# Altium schematic sheet Power supply.SchDoc
size 420 x 297 mm; SheetNumber: 1; SheetTotal: 1
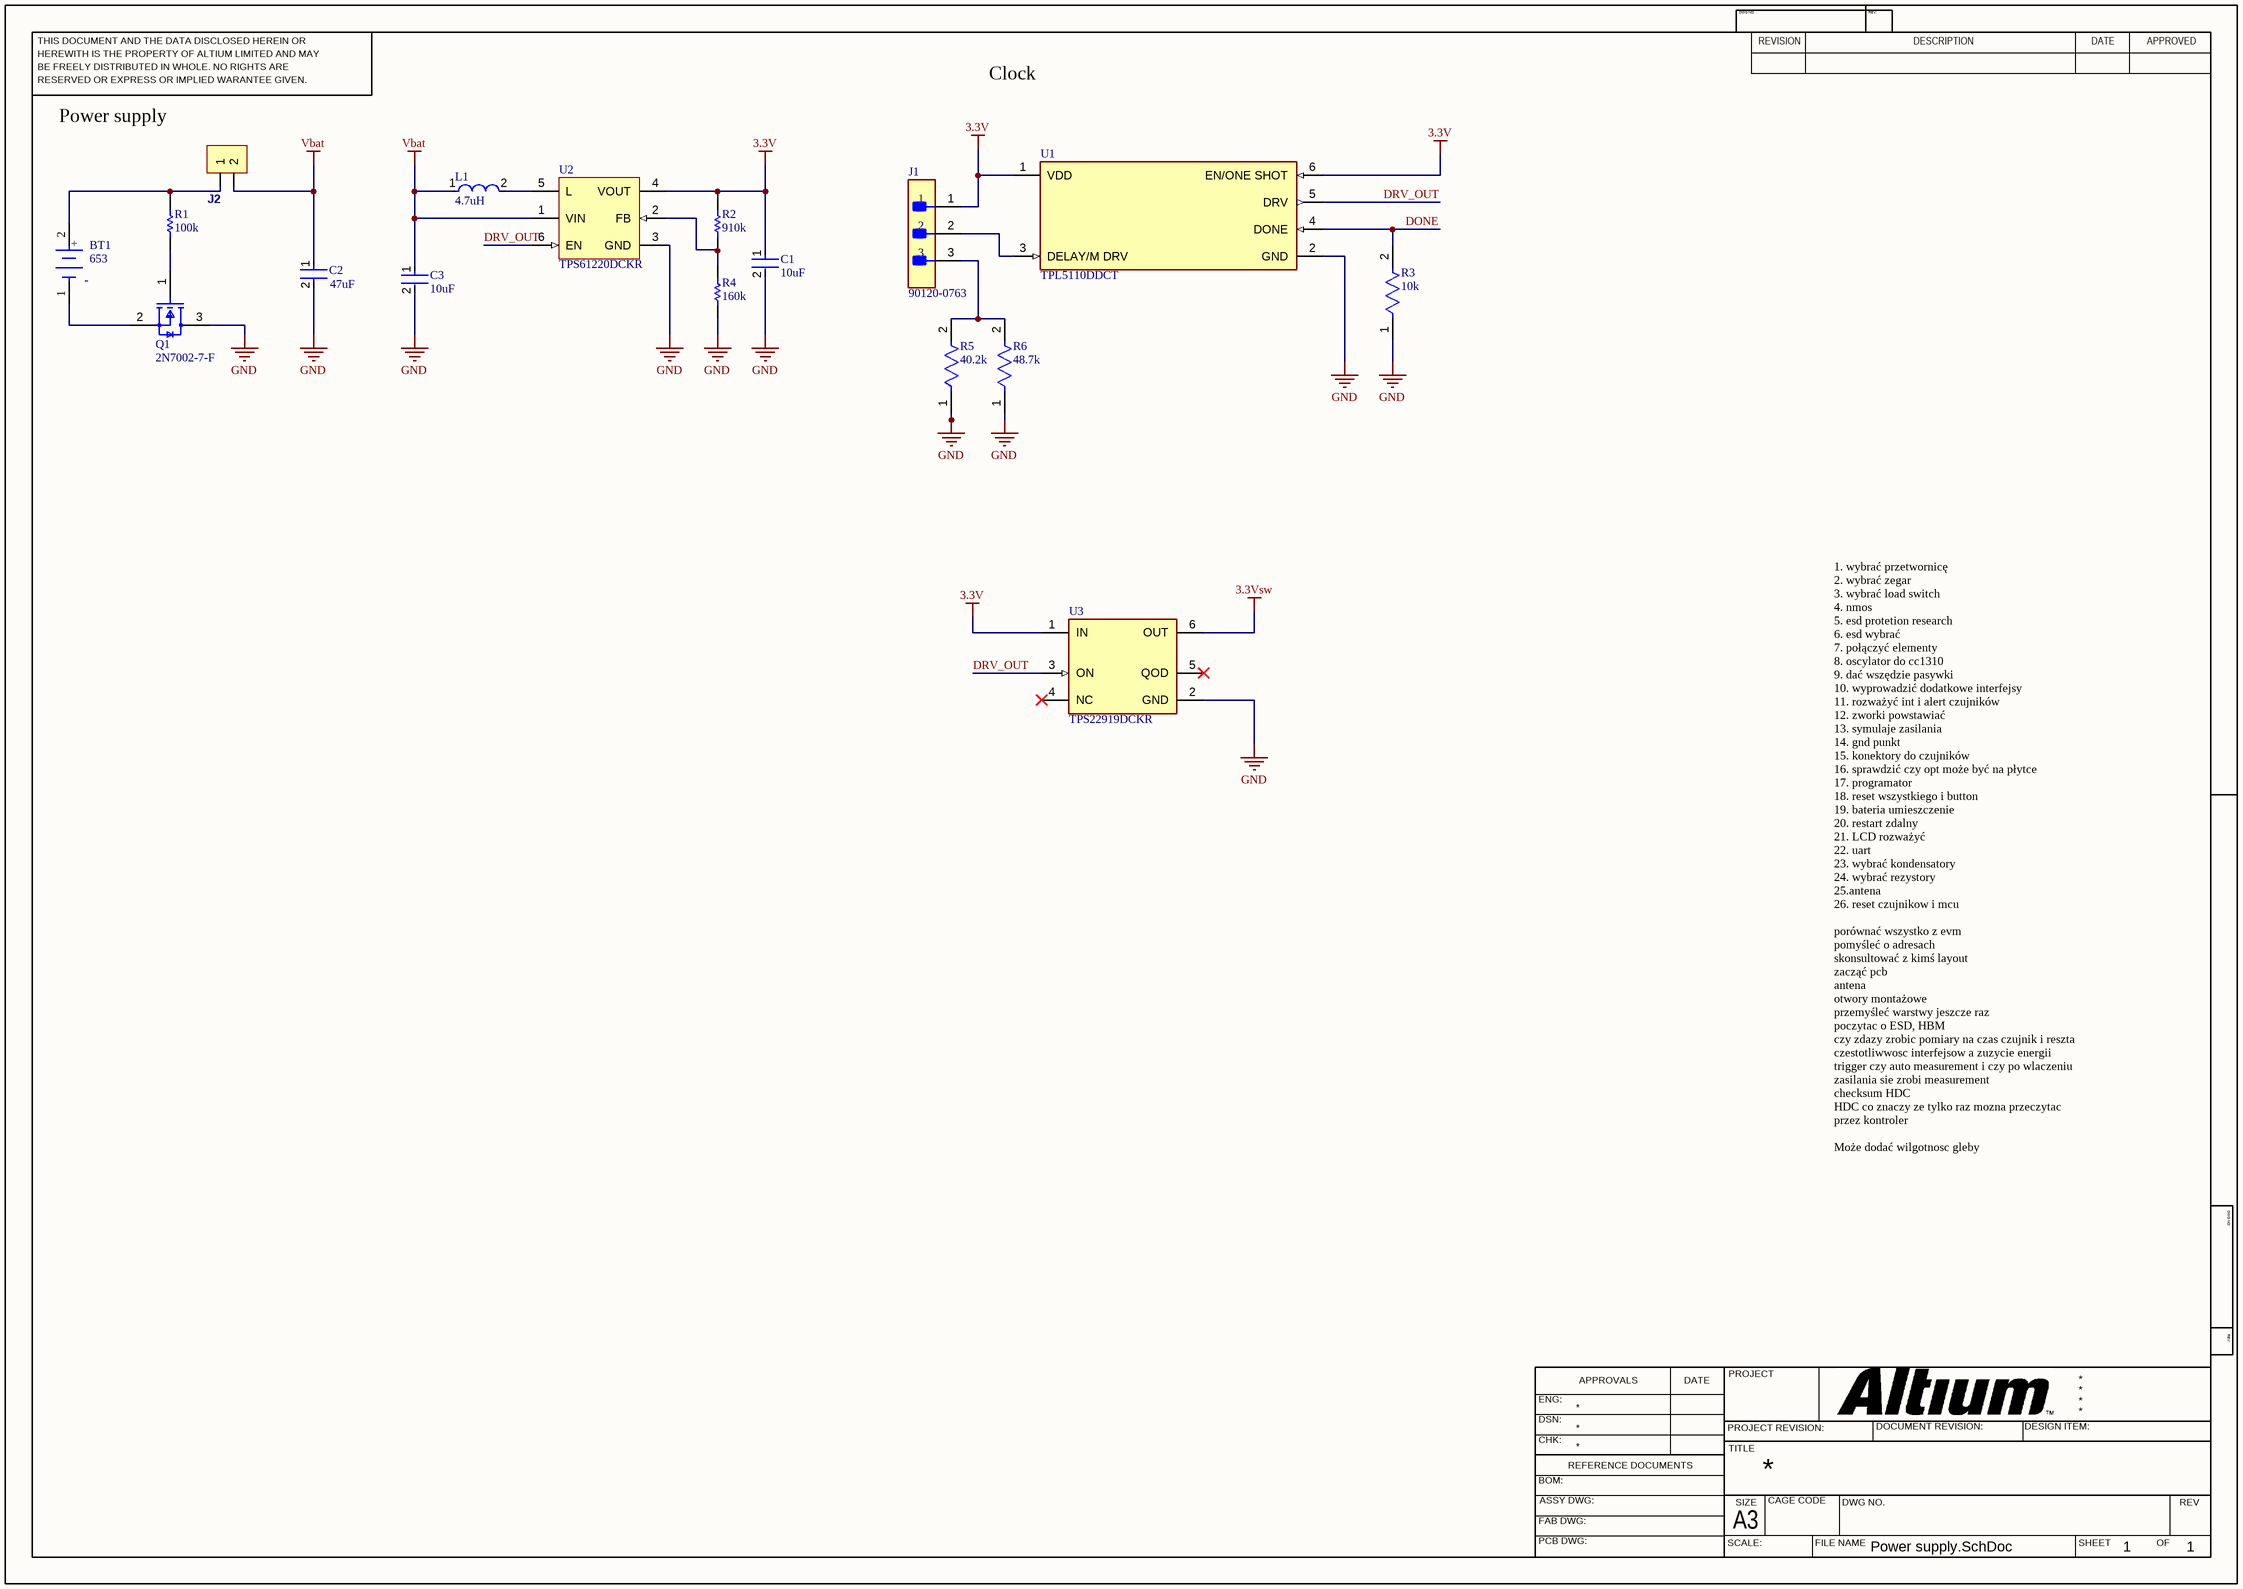
[diagram p0: Power supply.SchDoc]

## Parts
BT1  653  [FP-653-MFG]
C1  10uF  [FP-GRM188-0_2-MFG]
C2  47uF  [FP-GRM31C-0_2-e0_3_0_8-IPC_C]
C3  10uF  [FP-1210-L_3_3_0_4-W_2_5_0-IPC_A]
J1  90120-0763  [FP-90120-0763-MFG]
J2  CN_2x1  [GP_2x1]  (value not drawn)
L1  4.7uH  [FP-LQH3NPH_ME-MFG]
Q1  2N7002-7-F  [FP-SOT23-MFG]
R1  100k  [RESC0603(1608)_N]
R2  910k  [RESC3226X70X40NL20T20]
R3  10k  [FP-RK73HW3A-IPC_A]
R4  160k  [RESC3225X60X45LL20T20]
R5  40.2k  [FP-MCT0603-IPC_A]
R6  48.7k  [FP-MCT0603-IPC_A]
U1  TPL5110DDCT  [FP-DDC0006A-MFG]
U2  TPS61220DCKR  [DCK0006A_L]
U3  TPS22919DCKR  [FP-DCK0006A-MFG]

## Nets
3.3V: C1.1 J1.1 R2.2 U1.1(VDD) U1.6(EN/ONE_SHOT) U2.4(VOUT) U3.1(IN)
3.3Vsw: U3.6(OUT)
GND: C1.2 C2.2 C3.2 Q1.3(D) R3.1 R4.1 R5.1 R6.1 U1.2(GND) U2.3(GND) U3.2(GND)
Vbat: C2.1 C3.1 J2.2 L1.1 U2.1(VIN)
DONE: R3.2 U1.4(DONE)
DRV_OUT: U1.5(DRV) U2.6(EN) U3.3(ON)
NetBT1_1: BT1.1(C) Q1.2(S)
NetBT1_2: BT1.2(A) J2.1 R1.2
NetJ1_2: J1.2 U1.3(DELAY/M_DRV)
NetJ1_3: J1.3 R5.2 R6.2
NetL1_2: L1.2 U2.5(L)
NetQ1_1: Q1.1(G) R1.1
NetR2_1: R2.1 R4.2 U2.2(FB)

Not connected (* = marked no-connect by the designer): U3 4(NC)* 5(QOD)*

## Notes on the sheet
- Power supply
- Clock
- 1. wybrać przetwornicę
  2. wybrać zegar
  3. wybrać load switch
  4. nmos
  5. esd protetion research
  6. esd wybrać
  7. połączyć elementy
  8. oscylator do cc1310
  9. dać wszędzie pasywki
  10. wyprowadzić dodatkowe interfejsy
  11. rozważyć int i alert czujników
  12. zworki powstawiać
  13. symulaje zasilania
  14. gnd punkt
  15. konektory do czujników
  16. sprawdzić czy opt może być na płytce
  17. programator
  18. reset wszystkiego i button
  19. bateria umieszczenie
  20. restart zdalny
  21. LCD rozważyć
  22. uart
  23. wybrać kondensatory
  24. wybrać rezystory
  25.antena
  26. reset czujnikow i mcu
  porównać wszystko z evm
  pomyśleć o adresach
  skonsultować z kimś layout
  zacząć pcb
  antena
  otwory montażowe
  przemyśleć warstwy jeszcze raz
  poczytac o ESD, HBM
  czy zdazy zrobic pomiary na czas czujnik i reszta
  czestotliwwosc interfejsow a zuzycie energii
  trigger czy auto measurement i czy po wlaczeniu zasilania sie zrobi measurement
  checksum HDC
  HDC co znaczy ze tylko raz mozna przeczytac przez kontroler
  Może dodać wilgotnosc gleby
- THIS DOCUMENT AND THE DATA DISCLOSED HEREIN OR
- HEREWITH IS THE PROPERTY OF ALTIUM LIMITED AND MAY
- DWG NO:
- REVISION
- REV:
- DESCRIPTION
- DATE
- APPROVED
- BE FREELY DISTRIBUTED IN WHOLE. NO RIGHTS ARE
- RESERVED OR EXPRESS OR IMPLIED WARANTEE GIVEN.
- ENG:
- APPROVALS
- PROJECT
- DSN:
- CHK:
- REFERENCE DOCUMENTS
- PROJECT REVISION:
- TITLE
- DOCUMENT REVISION:
- DESIGN ITEM:
- BOM:
- FAB DWG:
- PCB DWG:
- ASSY DWG:
- SCALE:
- A3
- SIZE
- CAGE CODE
- FILE NAME
- DWG NO.
- SHEET
- OF
- REV
- (in symbol CMP-144256-000001-1) +; -

## Library data of the parts
BT1 = CMP-144256-000001-1: Adafruit Accessories Sewable CR2032 Battery Holder; Mount: Holder; Length: 4inch; Width: 2inch; Height: 0.5inch; Weight: 0.01lb
C1 = CMP-06035-041415-1: GRM188C81A106KA73D Chip Multilayer Ceramic Capacitors for General Purpose, 0603, 10uF, X6S, 22%, 10%, 10V; Voltage Rating (DC): 10V; Thickness: 800um; Length: 1.6mm; Dielectric: X6S; Width: 800um; Tolerance: 10%; Capacitance: 10uF
C2 = CMP-2000-05255-3: GRM31CR61A476ME15L Chip Multilayer Ceramic Capacitors for General Purpose, 1206, 47uF, X5R, 15%, 20%, 10V; Case/Package: 1206; Radiation Hardening: No; Case Code (Metric): 3216; Max Operating Temperature: 85°C; Capacitance: 47uF; Tolerance: 20%; REACH SVHC: No SVHC; Depth: 1.6mm; Case Code (Imperial): 1206; Termination: SMD/SMT; Voltage Rating (DC): 10V; Package Quantity: 2000; Voltage Rating: 10V; Width: 1.6mm; Lead Free: Lead Free; Voltage: 10V; Packaging: Tape and Reel; Length: 3.2mm; Height: 1.6mm; Number of Pins: 2; Thickness: 0.071inch; Min Operating Temperature: -55°C; Dielectric: X5R; Mount: Surface Mount
C3 = CMP-1038-02198-3: 1210ZC106KAT2A CAP CER 10UF 10V X7R 1210; Dissipation Factor: 5%; Tolerance: 10%; Capacitance: 10uF; Voltage Rating (DC): 10V; Case Code (Imperial): 1210; Termination: SMD/SMT; Min Operating Temperature: -55°C; Max Operating Temperature: 125°C; Voltage: 10V; RoHS Compliant: Yes; Lead Free: Lead Free; Construction: Flat; Case/Package: 1210; Dielectric: X7R; Width: 0.098inch; REACH SVHC: No SVHC; Mount: Surface Mount; Case Code (Metric): 3225; Depth: 2.5mm; Series: 1210; Voltage Rating: 10V; Packaging: Tape and Reel; Length: 3.2mm; Thickness: 0.11inch; Package Quantity: 1; Height: 2.79mm; Radiation Hardening: No
J1 = CMP-04776-000084-1: CONN HEADER VERT 3POS 2.54MM; Manufacturer: Molex; Voltage Rating: 350V; Number Of Contacts: 3; Conn Orientation: Vertical; Current Rating: 3A; Conn Gender: Male; Package: 90120-0763; ComponentLink2Description: Datasheet; Height: 5.8mm; Manufacturer Part Number: 90120-0763; Temperature Range High: +125°C; RoHS: TRUE; ComponentLink2URL: https://www.molex.com/webdocs/datasheets/pdf/en-us/0901200763_PCB_HEADERS.pdf; Device Class L2: Headers and Wire Housings; Temperature: -55°C to +125°C; Device Class L1: Connectors; Pitch: 2.54mm; Footprint Url: https://www.molex.com/pdm_docs/sd/901200763_sd.pdf; Device Class L3: unset; Temperature Range Low: -55°C; Number Of Rows: 1; Category: Conn; Lead Free: Yes; Mouser Description: Board-To-Board Connector, C-Grid III 90120 Series, Through Hole, Header, 3, 2.54 mm; Octopart: https://octopart.com/90120-0763-molex-655433; Contact Material: Gold,Nickel; Automotive: No; Digikey Description: CONN HEADER VERT 3POS 2.54MM
J2 = CMP-001-00125-1: Pins: 2; Design Item ID: CN_2x1; Component Type: Standard; Source: goldpin_male_sch.SchLib
L1 = CMP-06042-000007-2: LQH3NPZ4R7MMELWire Wound Ferrite Inductor for Power Lines For Automotive 4.7μH ±20% 0.12Ω 1700mA 1212; Shielding: Shielded; Saturation Current: 1.3A; Current Rating: 1.7A; DC Resistance (DCR): 120mR; Test Frequency: 1MHz; Self Resonant Frequency: 40MHz; Packaging: Cut Tape; Max Operating Temperature: 85°C; Min Operating Temperature: -40°C; Case/Package: 1212; Resistor Type: Wirewound; Inductance: 4.7uH; Mount: Surface Mount; Case Code (Imperial): 1212; Core Material: Ferrite; Ratings: AEC-Q200; Case Code (Metric): 3030; Tolerance: 20%
Q1 = CMP-2000-04929-2: MOSFET N-CH 60V 115MA SOT23-3; Turn-On Delay Time: 7ns; Turn-Off Delay Time: 11ns; Drain to Source Resistance: 7.5R; Rise Time: 3ns; Drain to Source Breakdown Voltage: 70V; Input Capacitance: 50pF; Number of Elements: 1; Power Dissipation: 540mW; Max Power Dissipation: 300mW; Fall Time: 5.6ns; Gate to Source Voltage (Vgs): 20V; Threshold Voltage: 2.5V; Element Configuration: Single; Termination: SMD/SMT; Weight: 0.000282oz; Radiation Hardening: No; Max Operating Temperature: 150°C; On-State Resistance: 7.5R; Mount: Surface Mount; Current Rating: 115mA; Contact Plating: Tin; Lead Free: Lead Free; Min Operating Temperature: -55°C; Number of Pins: 3; REACH SVHC: No SVHC; Drain to Source Voltage (Vdss): 60V; Width: 1.3mm; Package Quantity: 3000; Length: 2.9mm; Case/Package: SOT-23; Number of Channels: 1; Dual Supply Voltage: 60V; Packaging: Tape and Reel; Height: 1mm; Voltage Rating (DC): 60V; Nominal Vgs: 2.5V; Continuous Drain Current (ID): 115mA; Voltage: 60V; Rds On Max: 7.5R
R1 = CMP-1012-00736-1: 100K 0.1W 1% 0603 (1608 Metric)  SMD; Value: 100000.00 Ohm; Case-Metric: 1608; Case-EIA: 0603; Power: 0.1 W; Tolerance: 1 %; Technology: SMT
R2 = CMP-2005-01878-1: RK73B2ETTD914J; Manufacturer: KOA Speer; Part Number: RK73B2ETTD914J
R3 = CMP-04015-094217-1: RK73HW3ATTE1002F 10kΩ ±1% 1W Chip Resistor 2512 Thick Film AEC-Q200 Qualified; Resistance: 10kR; Length: 6.3mm; Lead Free: Lead Free; Max Operating Temperature: 155°C; RoHS Compliant: Yes; Packaging: Tape and Reel; Depth: 3.1mm; Power Rating: 1W; Min Operating Temperature: -55°C; Military Standard: Not; Tolerance: 1%; Case/Package: 2512; Resistor Type: Thick Film
R4 = CMP-2005-00577-1: CRCW1210160KJNEA; Manufacturer: Vishay Dale; Part Number: CRCW1210160KJNEA
R5 R6 = CMP-02407-001233-1: MCT06030C4029FP500 RES SMD 100 OHM 1% 1/8W 0603; Resistance: 40.2R; Depth: 0.85mm; Packaging: Tape and Reel; Tolerance: 1%; Composition: Thin Film; Military Standard: Not; Min Operating Temperature: -55°C; Length: 1.55mm; Width: 850um; Max Operating Temperature: 125°C; Lead Free: Lead Free; Case/Package: 0603
U1 = CMP-04858-000011-1: IC OSC PROG TIMER TSOT23-6; Manufacturer: Texas Instruments; Number Of Timers/Counters: 1; Max Supply Voltage: 5.5V; Max Junction Temp: +150°C; Standoff Height: 0mm; Nominal Supply Current: 0.035uA; Min Supply Voltage: 1.8V; Mouser Description: Timers & Support Products Ultra Lw Pwr Timer; Device Class L1: Integrated Circuits (ICs); ComponentLink2Description: Datasheet; Temperature Range Low: -40°C; Height: 1.1mm; Package: DDC0006A; Manufacturer Part Number: TPL5110DDCT; Device Class L2: Clock and Timing; Automotive: No; Octopart: https://octopart.com/tpl5110ddct-texas+instruments-52670271; Lead Free: Yes; RoHS: TRUE; Category: IC; Digikey Description: IC OSC PROG TIMER TSOT23-6; Device Class L3: Timers and Oscillators; Temperature Range High: +105°C; Temperature: -40°C to +105°C; ComponentLink2URL: http://www.ti.com/lit/ds/symlink/tpl5110.pdf
U2 = CMP-0347-00054-2: Boost Voltage Converter with 0.7 to 5.5 V Input and 1.8 to 5.5 V Output, -40 to 85 degC, 6-Pin SC70 (DCK), Green (RoHS & no Sb/Br); Manufacturer: Texas Instruments; SubFamily: Step-Up Regulator; Vout(Min)(V): 1.8; Vout(Max)(V): 5.5; Switching Frequency(Max)(kHz): 2000; Vin(Min)(V): 0.7; Regulated Outputs(#): 1; PackageReference: DCK0006A; PackageVersion: revG, Jan-2007; ComponentLink2Description: Package Specification; Topology: Boost; ComponentLink2URL: http://www.ti.com/litv/pdf/mpds114c; PackageDescription: 6-Pin Plastic Small-Outline Package, 2 x 1.3 mm Body, 0.65 mm Pitch, 2.1 mm Lead Span; ComponentLink1Description: Datasheet; DatasheetVersion: SLVS776; ComponentLink1URL: http://www.ti.com/general/docs/lit/getliterature.tsp?genericPartNumber=TPS61220&fileType=pdf; PartNumber: TPS61220DCKR; Code_JEDEC: MO-203-AB; Eco-Plan: Green (RoHS & no Sb/Br); Vin(Max)(V): 5.5; Mounting Technology: Surface Mount
U3 = CMP-04912-000027-1: POWER MANAGEMENT